# Altium schematic sheet Display.SchDoc
size B; Organization: VITRONIC Dr.-Ing. Stein Bildverarbeitungssysteme GmbH; Address1: Hasengartenstrasse 14; Address2: D-65189 Wiesbaden; Address3: Phone: 49/611/7152-0; Address4: Fax:     49/611/7152-133; SheetNumber: 2; SheetTotal: 3
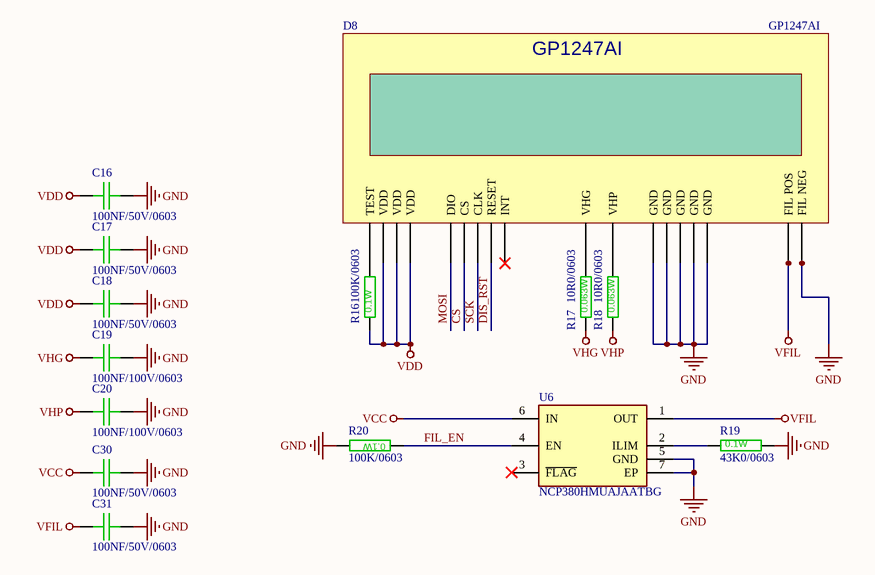
[diagram p0: Display.SchDoc]

## Parts
C16  100NF/50V/0603  [0603__R]
C17  100NF/50V/0603  [0603__R]
C18  100NF/50V/0603  [0603__R]
C19  100NF/100V/0603  [0603__R]
C20  100NF/100V/0603  [0603__R]
C30  100NF/50V/0603  [0603__R]
C31  100NF/50V/0603  [0603__R]
D8  GP1247AI  [GP1247AI]
R16  100K/0603  [0603__R]
R17  10R0/0603  [0603__R]
R18  10R0/0603  [0603__R]
R19  43K0/0603  [0603__R]
R20  100K/0603  [0603__R]
U6  NCP380HMUAJAATBG  [SON65P200X200X55-7N]

## Nets
GND: C16.1 C17.1 C18.1 C19.1 C20.1 C30.1 C31.1 D8.5(GND) D8.17(GND) D8.19(GND) D8.60(GND) D8.61(GND) D8.62(FIL_NEG) D8.63(FIL_NEG) D8.64(FIL_NEG) D8.65(FIL_NEG) R19.2 R20.2 U6.5(GND) U6.7(EP)
VCC: C30.2 U6.6(IN)
VDD: C16.2 C17.2 C18.2 D8.6(VDD) D8.14(VDD) D8.58(VDD) R16.1
VFIL: C31.2 D8.1(FIL_POS) D8.2(FIL_POS) D8.3(FIL_POS) D8.4(FIL_POS) U6.1(OUT)
VHG: C19.2 R17.1
VHP: C20.2 R18.1
CS: D8.12(CS)
DIS_RST: D8.10(RESET)
FIL_EN: R20.1 U6.4(EN)
MOSI: D8.11(DIO)
SCK: D8.13(CLK)
NetD8_9: D8.9(TEST) R16.2
NetD8_21: D8.21(VHG) R17.2
NetD8_59: D8.59(VHP) R18.2
NetR19_1: R19.1 U6.2(ILIM)

Not connected (* = marked no-connect by the designer): D8 7(NC) 8(NC) 15(INT)* 16(NC) 18(NC) 20(NC) 22(NC) 23(NC) 24(NC) 25(NC) 26(NC) 27(NC) 28(NC) 29(NC) 30(NC) 31(NC) 32(NC) 33(NC) 34(NC) 35(NC) 36(NC) 37(NC) 38(NC) 39(NC) 40(NC) 41(NC) 42(NC) 43(NC) 44(NC) 45(NC) 46(NC) 47(NC) 48(NC) 49(NC) 50(NC) 51(NC) 52(NC) 53(NC) 54(NC) 55(NC) 56(NC) 57(NC); U6 3(~{FLAG})*

## Notes on the sheet
- Bearbeiter
- Datum
- Titel:
- Erstellt
- Bearbeitet
- Geprüft
- Größe:
- B
- Nummer
- Revision:
- Status
- Seite
- von
- (in symbol 10R0/0603) 0.063W
- (in symbol 43K0/0603) 0.1W

## Library data of the parts
C16-C18 C30 C31 = 100NF/50V/0603: Capacitor, 100nF, 50V, 10%, Ceramic XR7, SMD, 0603; Manufacturer: KEMET; Manufacturer Part Number: C0603X104K5RACTU; Text Field1: 113024; Text Field7: 0603, 50V, ±10%, X7R; Kapazitätswert: 0.1; Dielektrische Charakteristik: X7R; Nennspannung: 50; Kondensatorgehäusestil: 0603 [1608 Metric]; Betriebstemperaturbereich: -55°C bis +125; SVHC: No SVHC (18-Jun-2012); Anschlusstyp: Surface Mount (SMD, SMT); Breite/Weite: 0.8; Gehäusetyp: 0603; Länge/Höhe, Außen-: 1.6; Min Betriebstemperatur: -55; Pin, Anzahl der: 2; Serie: FT; Temperatur, Betriebs- max.: 125; Supplier 1: Farnell; RoHS: YES; Stock 1: 97613; Pricing 1: 10=0,084, 100=0,042, 500=0,029, 1000=0,021, 4000=0,016 (EUR); Kapazitätstoleranz: ± 10%; Capacitor Terminals: SMD; Tiefe, Außen: 0.8; Toleranz +: 10%; Toleranz -: 10%; VDC Nennspannung: 50; ComponentLink1URL: http://www.farnell.com/datasheets/75233.pdf; ComponentLink1Description: http://www.farnell.com/datasheets/75233.pdf; ComponentLink2URL: http://www.farnell.com/cad/1558668.zip; ComponentLink2Description: http://www.farnell.com/cad/1558668.zip; Supplier Part Number 1: 1414028
C19 C20 = 100NF/50V/0603: Capacitor, 100nF, 100V, 10%, Ceramic XR7, SMD, 0603; Manufacturer: KEMET; Manufacturer Part Number: C0603X104K5RACTU; Text Field1: 113024; Text Field7: 0603, 50V, ±10%, X7R; Kapazitätswert: 0.1; Dielektrische Charakteristik: X7R; Nennspannung: 50; Kondensatorgehäusestil: 0603 [1608 Metric]; Betriebstemperaturbereich: -55°C bis +125; SVHC: No SVHC (18-Jun-2012); Anschlusstyp: Surface Mount (SMD, SMT); Breite/Weite: 0.8; Gehäusetyp: 0603; Länge/Höhe, Außen-: 1.6; Min Betriebstemperatur: -55; Pin, Anzahl der: 2; Serie: FT; Temperatur, Betriebs- max.: 125; Supplier 1: Farnell; RoHS: YES; Stock 1: 97613; Pricing 1: 10=0,084, 100=0,042, 500=0,029, 1000=0,021, 4000=0,016 (EUR); Kapazitätstoleranz: ± 10%; Capacitor Terminals: SMD; Tiefe, Außen: 0.8; Toleranz +: 10%; Toleranz -: 10%; VDC Nennspannung: 50; ComponentLink1URL: http://www.farnell.com/datasheets/75233.pdf; ComponentLink1Description: http://www.farnell.com/datasheets/75233.pdf; ComponentLink2URL: http://www.farnell.com/cad/1558668.zip; ComponentLink2Description: http://www.farnell.com/cad/1558668.zip; Supplier Part Number 1: 1414028
D8 = GP1247AI: 253*63 Pixels SPI VFD Matrix Display
R16 R20 = 100K/0603: Resistor, 100K, 0.1W, 1%, TK50, Metallschicht, SMD, 0603; Text Field1: 70755; Text Field3: 0603; Text Field7: 0603, 0,1 W, 1,0 %, TK50; Text Field8: 4; Text Field2: SMD; Text Field4: 100K; Text Field5: 0.1W; Text Field6: 1%, TK50
R17 R18 = 10R0/0603: Resistor, 10R0, 0.063W, 1%, TK200, Metallschicht, SMD, 0603; Manufacturer: VISHAY; Manufacturer Part Number: MCT 0603-50 1% P5 10R0; Text Field1: 70916; Text Field7: 0603, 0,063W, 1,0 %, TK200; Product Range: VISHAY - MCT Series; Resistance: 10; Power Rating: 100; Resistor Case Style: 0603 [1608 Metric]; Resistor Element Material: Thin Film; Supplier 1: Newark; RoHS: YESX; Stock 1: 4700; Pricing 1: 50=0,063, 250=0,048, 500=0,042, 1000=0,038, 5000=0,035 (USD); Resistance Tolerance: ± 1%; ComponentLink1URL: http://www.farnell.com/datasheets/1718110.pdf; ComponentLink1Description: http://www.farnell.com/datasheets/1718110.pdf; Supplier Part Number 1: 06X6013
R19 = 43K0/0603: Resistor, 43K0, 0,1 W, 1,0 %, TK50,  Metallschicht, SMD, 0603; Text Field1: 69417; Text Field3: 0603; Text Field5: 0,1W; Text Field6: 1%, TK50; Text Field7: 0603, 0,1 W, 1,0 %, TK50; Text Field8: 4; Text Field2: SMD; Text Field4: 43K0
U6 = NCP380HMUAJAATBG: ON SEMICONDUCTOR - NCP380HMUAJAATBG - Power Load Switch, Current Limiting, High Side, Active High, 1 Output, 5.5V, UDFN-6; Manufacturer_Name: onsemi; Geometry.Height: 0.55mm; Mouser Part Number: 863-NCP380HMUAJAATBG; Mouser Price/Stock: https://www.mouser.co.uk/ProductDetail/onsemi/NCP380HMUAJAATBG?qs=YeOvDzlQW72pe7df1sK96A%3D%3D; Manufacturer_Part_Number: NCP380HMUAJAATBG; Datasheet Link: http://www.onsemi.com/pub/Collateral/NCP380-D.PDF